# EAGLE board PCB-CMB-6_SKAARDUINO (EAGLE 7.1.0), part 1 of 2
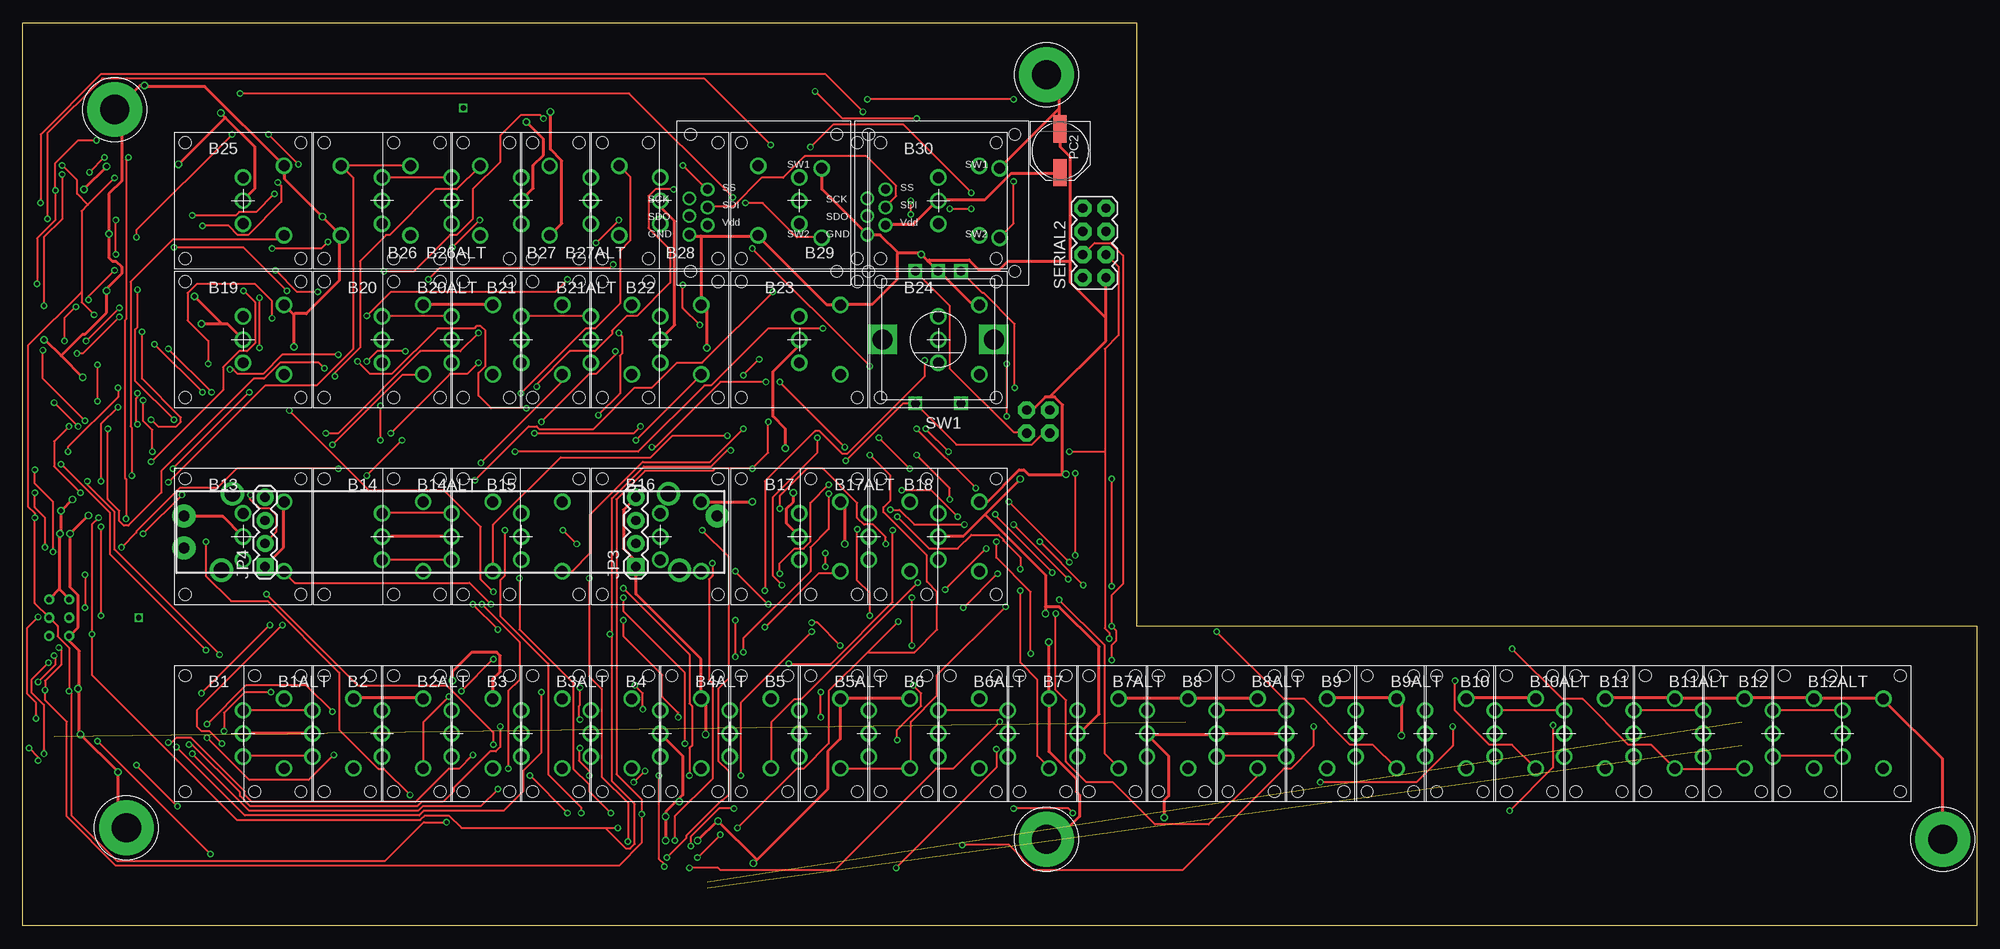
[diagram p6: board, top side]
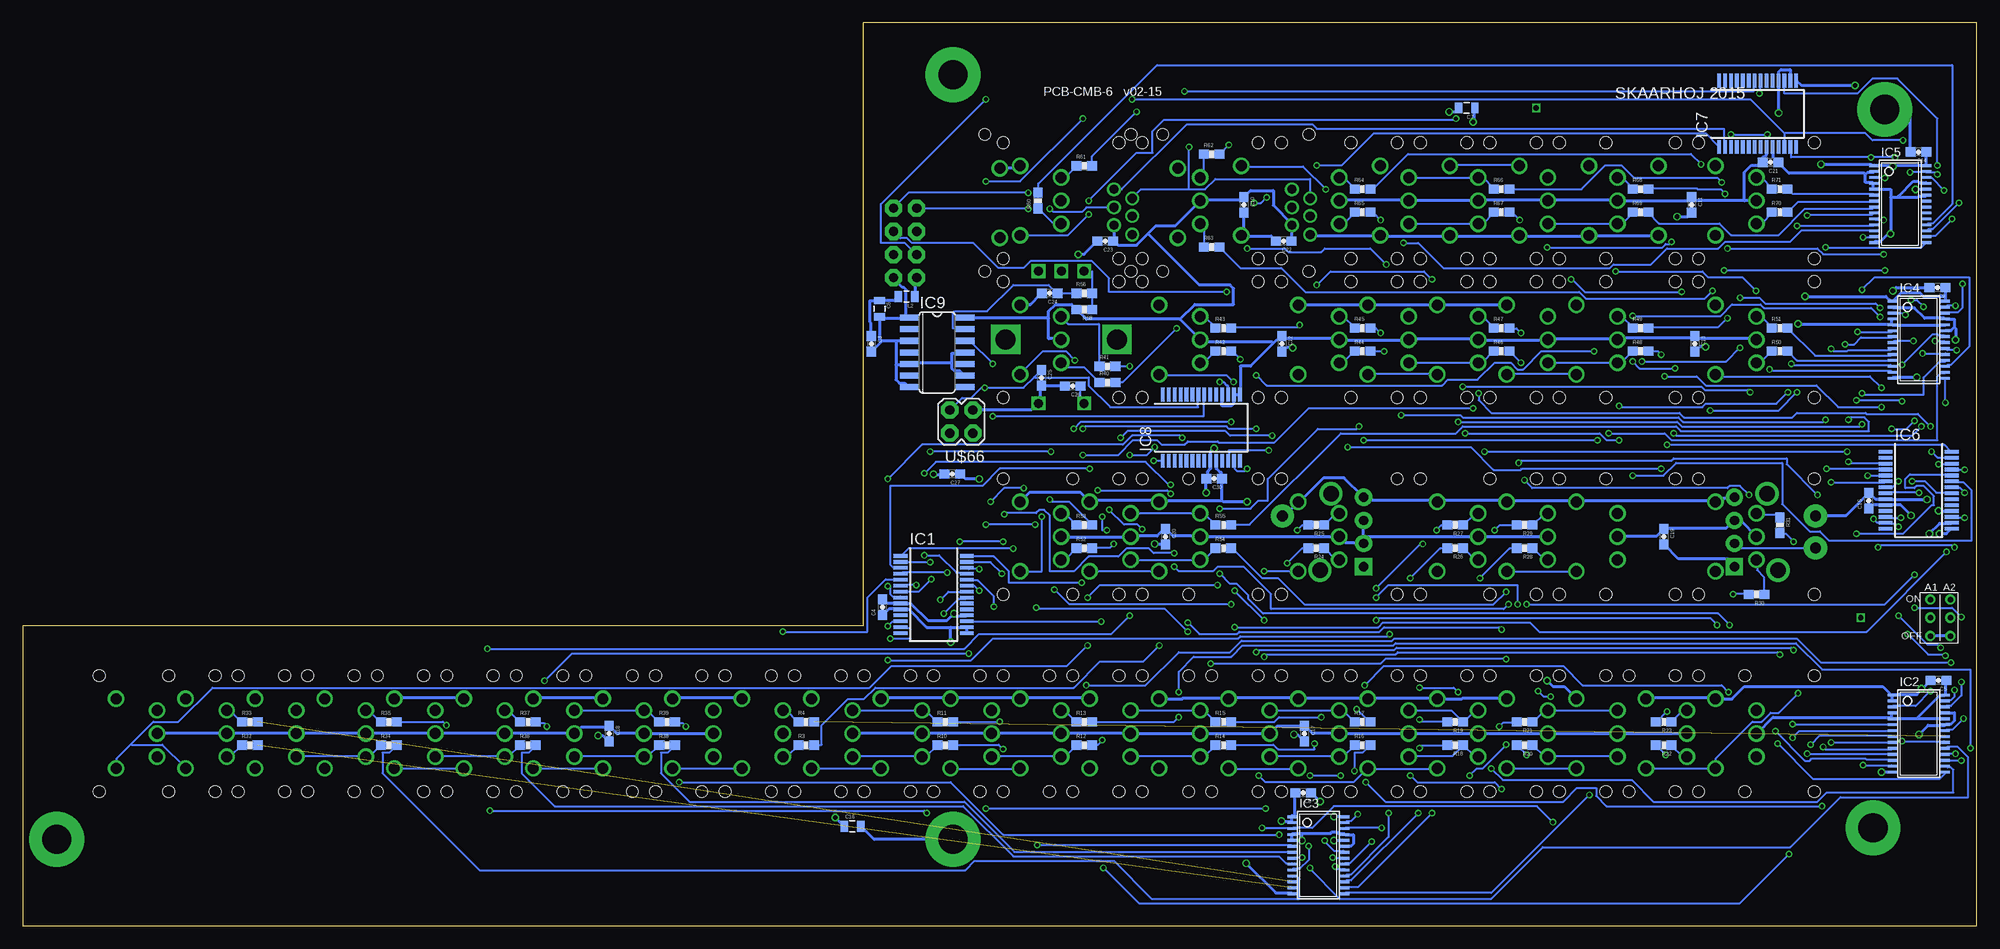
[diagram p7: board, bottom side, seen from below]

Size 214.11 x 99 mm. Coordinates in mm from the lower left corner, seen from the top.
Outline: 0,0 0,99 122.04,99 122.04,32.91 214.11,32.91 214.11,0 0,0
Copper layers (1*16): Top 0.035mm / dielectric 1.5mm / Bottom 0.035mm
Design rules "Fusion_eagle_rule_v1.1": minimum track width 6mil, minimum drill 12mil, track to track 6mil, track to pad 6mil, pad to pad 6mil, via to via 6mil, smd to smd 0mil, copper to edge 10mil, drill to drill 10mil, minimum pad ring 10mil, minimum via ring 6mil, stop-mask expansion 2mil, vias tented up to drill 100mil, thermal gap 10mil
Net classes: 0 default: width 0.203 mm, drill 0.406 mm, clearance 0.203 mm; 1 Power: width 0.356 mm, drill 0.508 mm, clearance 0.203 mm
tRestrict: area -3.8,-0.5 to 219.2,6; area -3.8,93.5 to 179.2,99.5
bRestrict: area -3.8,97 to 179.2,99.5; area -3.8,-0.5 to 219.2,2

## Footprints (pad centres in the part's own frame; a part is rotated, then mirrored left to right if it is on the bottom)
LP11 = drill 1.2: COM 0,0; P$2 0,2.54; P$3 0,-2.54; P$4 4.5,3.81; P$5 4.5,-3.81 | hole 1.3: -6.35,6.35; 6.35,6.35; 6.35,-6.35; -6.35,-6.35
0603-CAP = smd 1.1 x 1: 1 -0.85,0; 2 0.85,0
0805 = smd 0.8 x 1.2: 1 -0.9,0; 2 0.9,0
SSOP28 = smd 0.4 x 1.5: 1 -4.225,-3.625; 2 -3.575,-3.625; 3 -2.925,-3.625; 4 -2.275,-3.625; 5 -1.625,-3.625; 6 -0.975,-3.625; 7 -0.325,-3.625; 8 0.325,-3.625; 9 0.975,-3.625; 10 1.625,-3.625; 11 2.275,-3.625; 12 2.925,-3.625; 13 3.575,-3.625; 14 4.225,-3.625; 15 4.225,3.625; 16 3.575,3.625; 17 2.925,3.625; 18 2.275,3.625; 19 1.625,3.625; 20 0.975,3.625; 21 0.325,3.625; 22 -0.325,3.625; 23 -0.975,3.625; 24 -1.625,3.625; 25 -2.275,3.625; 26 -2.925,3.625; 27 -3.575,3.625; 28 -4.225,3.625
TSSOP28 = smd 0.305 x 0.991: 1 -4.225,-2.918; 2 -3.575,-2.918; 3 -2.925,-2.918; 4 -2.275,-2.918; 5 -1.625,-2.918; 6 -0.975,-2.918; 7 -0.325,-2.918; 8 0.325,-2.918; 9 0.975,-2.918; 10 1.625,-2.918; 11 2.275,-2.918; 12 2.925,-2.918; 13 3.575,-2.918; 14 4.225,-2.918; 15 4.225,2.918; 16 3.575,2.918; 17 2.925,2.918; 18 2.275,2.918; 19 1.625,2.918; 20 0.975,2.918; 21 0.325,2.918; 22 -0.325,2.918; 23 -0.975,2.918; 24 -1.625,2.918; 25 -2.275,2.918; 26 -2.925,2.918; 27 -3.575,2.918; 28 -4.225,2.918
SO14 = smd 0.66 x 2.032: 1 -3.81,-3.073; 2 -2.54,-3.073; 3 -1.27,-3.073; 4 0,-3.073; 5 1.27,-3.073; 6 2.54,-3.073; 7 3.81,-3.073; 8 3.81,3.073; 9 2.54,3.073; 10 1.27,3.073; 11 0,3.073; 12 -1.27,3.073; 13 -2.54,3.073; 14 -3.81,3.073
1X04 = drill 1.016 pad 1.88 square: 1 0,0 | drill 1.016 pad 1.88: 2 2.54,0; 3 5.08,0; 4 7.62,0
PANASONIC_D = smd 3 x 1.4: + 2.4,0; - -2.4,0
SLIDER45 = drill 1.194 pad 2.54: 1 -29.21,1.75; 2A -29.21,-1.75; 3 29.21,1.75 | drill 1.702: P$1 -23.9,4.2; P$2 23.9,4.2; P$3 25.1,-4.2; P$4 -25.1,-4.2
0603-RES = smd 1.1 x 1: 1 -0.85,0; 2 0.85,0
2X4 = drill 1.016 pad 1.88 octagon: 1 -3.81,-1.27; 2 -3.81,1.27; 3 -1.27,-1.27; 4 -1.27,1.27; 5 1.27,-1.27; 6 1.27,1.27; 7 3.81,-1.27; 8 3.81,1.27
SMART_SWITCH = drill 1.2: 1 6.35,3.81; 2 6.35,-3.81 | drill 1: 3 -8.153,-3.48; 4 -6.147,-2.413; 5 -8.153,-1.422; 6 -6.147,-0.483; 7 -8.153,0.508; 8 -6.147,1.499 | hole 1.3: -8.001,7.506; 8.001,7.506; 8.001,-7.506; -8.001,-7.506
ALPS_EC12E_SW = drill 1 square: A -2.5,-7.5; B 2.5,-7.5; C 0,-7.5; D -2.5,7; E 2.5,7 | drill 2.2 square: GND1 -6.1,0; GND2 6.1,0
3.2MMPAD6MM = drill 3.2 pad 6: P$1 0,0
2BITADDR = drill 0.6: A1 0,0; A2 2.2,0; H2 0,2; H3 2.2,2; L2 0,-2; L3 2.2,-2
2X2 = drill 1.016 pad 1.88 octagon: 1 -3.81,-1.27; 2 -3.81,1.27; 3 -1.27,-1.27; 4 -1.27,1.27

## Placement (x,y rotation side)
B1  LP11-B"  [LP11]  24.13,21.09 0 top
B1ALT  LP11-B"  [LP11]  31.75,21.09 0 top
B2  LP11-B"  [LP11]  39.37,21.09 0 top
B2ALT  LP11-B"  [LP11]  46.99,21.09 0 top
B3  LP11-B"  [LP11]  54.61,21.09 0 top
B3ALT  LP11-B"  [LP11]  62.23,21.09 0 top
B4  LP11-B"  [LP11]  69.85,21.09 0 top
B4ALT  LP11-B"  [LP11]  77.47,21.09 0 top
B5  LP11-B"  [LP11]  85.09,21.09 0 top
B5ALT  LP11-B"  [LP11]  92.71,21.09 0 top
B6  LP11-B"  [LP11]  100.33,21.09 0 top
B6ALT  LP11-B"  [LP11]  107.95,21.09 0 top
B7  LP11-B"  [LP11]  115.57,21.09 0 top
B7ALT  LP11-B"  [LP11]  123.19,21.09 0 top
B8  LP11-B"  [LP11]  130.81,21.09 0 top
B8ALT  LP11-B"  [LP11]  138.43,21.09 0 top
B9  LP11-B"  [LP11]  146.05,21.09 0 top
B9ALT  LP11-B"  [LP11]  153.67,21.09 0 top
B10  LP11-B"  [LP11]  161.29,21.09 0 top
B10ALT  LP11-B"  [LP11]  168.91,21.09 0 top
B11  LP11-B"  [LP11]  176.53,21.09 0 top
B11ALT  LP11-B"  [LP11]  184.15,21.09 0 top
B12  LP11-B"  [LP11]  191.77,21.09 0 top
B12ALT  LP11-B"  [LP11]  199.39,21.09 0 top
B13  LP11-B"  [LP11]  24.13,42.68 0 top
B14  LP11-B"  [LP11]  39.37,42.68 0 top
B14ALT  LP11-B"  [LP11]  46.99,42.68 0 top
B15  LP11-B"  [LP11]  54.61,42.68 0 top
B16  LP11-B"  [LP11]  69.85,42.68 0 top
B17  LP11-B"  [LP11]  85.09,42.68 0 top
B17ALT  LP11-B"  [LP11]  92.71,42.68 0 top
B18  LP11-B"  [LP11]  100.33,42.68 0 top
B19  LP11-B"  [LP11]  24.13,64.27 0 top
B20  LP11-B"  [LP11]  39.37,64.27 0 top
B20ALT  LP11-B"  [LP11]  46.99,64.27 0 top
B21  LP11-B"  [LP11]  54.61,64.27 0 top
B21ALT  LP11-B"  [LP11]  62.23,64.27 0 top
B22  LP11-B"  [LP11]  69.85,64.27 0 top
B23  LP11-B"  [LP11]  85.09,64.27 0 top
B24  LP11-B"  [LP11]  100.33,64.27 0 top
B25  LP11-B"  [LP11]  24.13,79.51 0 top
B26  LP11-B"  [LP11]  39.37,79.51 180 top
B26ALT  LP11-B"  [LP11]  46.99,79.51 180 top
B27  LP11-B"  [LP11]  54.61,79.51 180 top
B27ALT  LP11-B"  [LP11]  62.23,79.51 180 top
B28  LP11-B"  [LP11]  69.85,79.51 180 top
B29  LP11-B"  [LP11]  85.09,79.51 180 top
B30  LP11-B"  [LP11]  100.33,79.51 0 top
C3  100nF  [0603-CAP]  121.13,63.8 270 bottom
C4  100nF  [0603-CAP]  119.89,34.93 90 bottom
C5  100nF  [0603-CAP]  4.19,26.93 180 bottom
C6  22uF  [0805]  120.24,67.66 270 bottom
C7  22uF  [0805]  55.88,89.67 180 bottom
C8  100nF  [0603-CAP]  73.79,14.61 180 bottom
C9  100nF  [0603-CAP]  4.32,69.98 180 bottom
C10  100nF  [0603-CAP]  80.31,79.05 270 bottom
C11  100nF  [0603-CAP]  31.24,79.05 270 bottom
C12  100nF  [0603-CAP]  76.15,63.81 270 bottom
C13  100nF  [0603-CAP]  30.89,63.81 270 bottom
C14  100nF  [0603-CAP]  6.35,84.84 180 bottom
C15  100nF  [0603-CAP]  11.81,46.62 90 bottom
C16  22uF  [0805]  123.19,10.93 0 bottom
C17  100nF  [0603-CAP]  73.66,21.09 270 bottom
C18  100nF  [0603-CAP]  149.86,21.09 270 bottom
C19  100nF  [0603-CAP]  34.29,42.68 270 bottom
C20  100nF  [0603-CAP]  88.9,42.68 270 bottom
C21  100nF  [0603-CAP]  22.61,83.7 180 bottom
C22  100nF  [0603-CAP]  75.95,75.06 180 bottom
C23  100nF  [0603-CAP]  95.5,75.06 180 bottom
C24  10nF  [0603-CAP]  101.6,69.35 180 bottom
C25  10nF  [0603-CAP]  102.49,60.08 270 bottom
C26  10nF  [0603-CAP]  99.06,59.19 180 bottom
C27  100nF  [0603-CAP]  112.27,49.54 180 bottom
C30  100nF  [0603-CAP]  83.57,49.03 180 bottom
IC1  MCP23017SS  [SSOP28]  114.3,36.33 270 bottom
IC2  PCA9685  [TSSOP28]  6.35,21.09 270 bottom
IC3  PCA9685  [TSSOP28]  72.14,7.76 270 bottom
IC4  PCA9685  [TSSOP28]  6.35,64.27 270 bottom
IC5  PCA9685  [TSSOP28]  8.38,79.13 270 bottom
IC6  MCP23017SS  [SSOP28]  6.35,47.76 270 bottom
IC7  MCP23017SS  [SSOP28]  24,89.03 0 bottom
IC8  MCP23017SS  [SSOP28]  84.96,54.62 0 bottom
IC9  74HCT14D  [SO14]  113.92,62.87 270 bottom
JP3  [1X04]  67.18,39.38 90 top
JP4  [1X04]  26.54,39.38 90 top
L2  [0805]  117.27,68.99 180 bottom
PC2  47u  [PANASONIC_D]  113.66,84.97 270 top
POT1  SLIDER45  [SLIDER45]  46.86,43.19 0 top
R3  270  [0603-RES]  128.27,19.82 0 bottom
R4  270  [0603-RES]  128.27,22.36 0 bottom
R10  270  [0603-RES]  113.03,19.82 0 bottom
R11  270  [0603-RES]  113.03,22.36 0 bottom
R12  270  [0603-RES]  97.79,19.82 0 bottom
R13  270  [0603-RES]  97.79,22.36 0 bottom
R14  270  [0603-RES]  82.55,19.82 0 bottom
R15  270  [0603-RES]  82.55,22.36 0 bottom
R16  270  [0603-RES]  67.31,19.82 0 bottom
R17  270  [0603-RES]  67.31,22.36 0 bottom
R18  270  [0603-RES]  57.15,19.82 180 bottom
R19  270  [0603-RES]  57.15,22.36 180 bottom
R20  270  [0603-RES]  49.53,19.82 180 bottom
R21  270  [0603-RES]  49.53,22.36 180 bottom
R22  270  [0603-RES]  34.29,19.82 180 bottom
R23  270  [0603-RES]  34.29,22.36 180 bottom
R24  270  [0603-RES]  72.39,41.41 180 bottom
R25  270  [0603-RES]  72.39,43.95 180 bottom
R26  270  [0603-RES]  57.15,41.41 180 bottom
R27  270  [0603-RES]  57.15,43.95 180 bottom
R28  270  [0603-RES]  49.53,41.41 180 bottom
R29  270  [0603-RES]  49.53,43.95 180 bottom
R30  270  [0603-RES]  24.13,36.33 180 bottom
R31  270  [0603-RES]  21.59,43.95 270 bottom
R32  270  [0603-RES]  189.23,19.82 0 bottom
R33  270  [0603-RES]  189.23,22.36 0 bottom
R34  270  [0603-RES]  173.99,19.82 0 bottom
R35  270  [0603-RES]  173.99,22.36 0 bottom
R36  270  [0603-RES]  158.75,19.82 0 bottom
R37  270  [0603-RES]  158.75,22.36 0 bottom
R38  270  [0603-RES]  143.51,19.82 0 bottom
R39  270  [0603-RES]  143.51,22.36 0 bottom
R40  270  [0603-RES]  95.25,59.57 0 bottom
R41  270  [0603-RES]  95.25,61.35 0 bottom
R42  270  [0603-RES]  82.55,63 0 bottom
R43  270  [0603-RES]  82.55,65.54 0 bottom
R44  270  [0603-RES]  67.31,63 0 bottom
R45  270  [0603-RES]  67.31,65.54 0 bottom
R46  270  [0603-RES]  52.07,63 0 bottom
R47  270  [0603-RES]  52.07,65.54 0 bottom
R48  270  [0603-RES]  36.83,63 0 bottom
R49  270  [0603-RES]  36.83,65.54 0 bottom
R50  270  [0603-RES]  21.59,63 0 bottom
R51  270  [0603-RES]  21.59,65.54 0 bottom
R52  270  [0603-RES]  97.79,41.41 0 bottom
R53  270  [0603-RES]  97.79,43.95 0 bottom
R54  270  [0603-RES]  82.55,41.41 0 bottom
R55  270  [0603-RES]  82.55,43.95 0 bottom
R56  0R  [0603-RES]  97.79,69.35 0 bottom
R58  100K  [0603-RES]  97.79,67.57 180 bottom
R60  270  [0603-RES]  102.87,79.51 90 bottom
R61  270  [0603-RES]  97.79,83.32 0 bottom
R62  270  [0603-RES]  83.82,84.59 0 bottom
R63  270  [0603-RES]  83.82,74.43 0 bottom
R64  270  [0603-RES]  67.31,80.78 0 bottom
R65  270  [0603-RES]  67.31,78.24 0 bottom
R66  270  [0603-RES]  52.07,80.78 0 bottom
R67  270  [0603-RES]  52.07,78.24 0 bottom
R68  270  [0603-RES]  36.83,80.78 0 bottom
R69  270  [0603-RES]  36.83,78.24 0 bottom
R70  270  [0603-RES]  21.59,78.24 0 bottom
R71  270  [0603-RES]  21.59,80.78 0 bottom
SERIAL2  M04X2  [2X4]  117.43,74.87 90 top
SSW1  SMART_SWITCHSMART_SWITCH_8PIN  [SMART_SWITCH]  81.19,79.25 0 top
SSW2  SMART_SWITCHSMART_SWITCH_8PIN  [SMART_SWITCH]  100.69,79.25 0 top
SW1  EC12E_SW  [ALPS_EC12E_SW]  100.31,64.29 180 top
U$7  GNDPAD6MM  [3.2MMPAD6MM]  210.38,9.5 0 top
U$15  GNDPAD6MM  [3.2MMPAD6MM]  112.19,9.5 0 top
U$18  GNDPAD6MM  [3.2MMPAD6MM]  112.19,93.31 0 top
U$20  GNDPAD6MM  [3.2MMPAD6MM]  11.35,10.77 0 top
U$21  GNDPAD6MM  [3.2MMPAD6MM]  10.08,89.5 0 top
U$34  2BITADDR  [2BITADDR]  5.08,33.79 0 bottom
U$66  M02X2  [2X2]  113.81,55.29 180 bottom

## Tracks (layer width: path | path; a pad name or v marks a point on that pad's centre or on a via)
5V  (via drill 0.51)
  Top 0.356: v9.19,83.25 v6.69,80.75 | 22.19,88.62 25.44,85.38 25.44,80.88 24.19,79.62 B25.COM | 22.19,88.62 v21.69,89.12 | 22.19,88.62 v17.07,83.5 | v55.19,88.12 57.06,86.25 57.06,84.5 55.94,83.38 55.94,80.88 54.69,79.62 B27.COM | PC2.+ 113.56,82.5 108.31,82.5 105.44,79.62 100.44,79.62 B30.COM 100.19,79.5 97.56,76.88 94.56,76.88 SSW2.4 | 21.69,66 22.44,66 24.07,64.38 B19.COM | 21.69,66 v19.57,66 | v18.82,69 21.69,66.12 21.69,66 | B28.COM 69.94,79.5 69.94,78.75 71.44,77.25 71.44,65.88 69.94,64.38 B22.COM | v84.44,47.5 84.44,46.5 83.69,45.75 83.69,44.12 85.06,42.75 B17.COM | 105.44,45.12 103.06,42.75 100.44,42.75 B18.COM | 105.44,45.12 v109.31,49 | 112.06,35 112.06,38.5 105.44,45.12 | 112.06,35 v112.06,34.25 | 4.06,36.88 v4.06,43 4.19,43.12 v4.19,45.5 v5.44,46.75 | 4.06,36.88 5.06,35.88 U$34.H2 | U$34.H3 2.94,35.88 3.94,36.88 4.06,36.88 | B14ALT.COM 46.94,42.75 39.44,42.75 B14.COM | POT1.1 17.69,44.88 21.94,44.88 24.07,42.75 B13.COM | v125.06,11.88 125.06,13.75 125.56,14.25 125.56,18.62 123.19,21 B7ALT.COM 123.44,21 130.69,21 B8.COM 130.94,21.12 138.31,21.12 B8ALT.COM | B1.COM 24.19,21.12 31.69,21.12 B1ALT.COM | v70.44,9.38 v70.44,12 70.44,12.5 71.69,13.75 | 71.69,13.75 72.31,14.38 72.31,18.62 B4.COM | v71.94,13.62 71.81,13.62 71.69,13.75 | 112.06,35 113.56,35 117.94,30.62 117.94,23.25 115.69,21 B7.COM | v83.56,52.38 83.56,54.5 82.19,55.88 82.19,60.75 85.06,63.62 85.06,64.25 B23.COM
  Bottom 0.356: C14.1 5.56,84.75 5.56,83.38 IC5.28 5.69,83.38 9.06,83.38 v9.19,83.25 9.31,83.38 11.19,83.38 IC5.1 11.44,83.38 11.56,83.5 v17.07,83.5 | v6.69,80.75 5.56,80.75 IC5.24 | IC7.16 20.44,92.75 20.44,93.88 21.44,93.88 21.69,93.62 21.69,92.75 IC7.18 21.69,92.5 v21.69,89.12 | IC7.9 23.07,85.38 23.07,84.5 23.32,84.25 23.44,84.25 23.44,83.75 C21.2 23.57,83.62 23.82,83.38 24.69,83.38 25.44,82.62 25.44,79.5 | 25.44,79.5 24.19,79.5 B25.COM | 25.44,79.5 30.82,79.5 31.19,79.88 C11.1 31.32,79.75 31.57,79.5 39.19,79.5 B26.COM 39.44,79.62 46.94,79.62 B26ALT.COM 47.06,79.62 54.56,79.62 B27.COM 54.69,79.5 62.06,79.5 B27ALT.COM 62.31,79.62 69.81,79.62 B28.COM | v55.19,88.12 55.06,88.12 55.06,89.62 C7.1 | C22.1 75.06,75.12 75.06,76.75 SSW1.4 75.06,77 77.06,79 77.06,80.62 79.56,80.62 80.19,80 C10.1 80.31,79.88 80.56,79.62 85.06,79.62 B29.COM 85.19,79.38 87.81,76.75 89.94,76.75 90.81,75.88 | SSW2.4 94.56,76.75 94.56,75.12 C23.1 94.44,75 94.06,74.62 92.06,74.62 90.81,75.88 | 3.44,69 3.44,69.88 C9.1 | 3.44,69 IC4.28 | 3.44,69 5.81,69 6.19,69.38 8.31,69.38 9.19,68.5 IC4.1 9.44,68.5 9.94,69 v18.82,69 | IC4.24 3.44,65.88 9.19,65.88 IC4.5 | IC4.4 9.31,66.5 9.31,66 IC4.5 | B19.COM 24.19,64.38 30.57,64.38 30.82,64.62 C13.1 31.07,64.62 31.19,64.5 39.31,64.5 B20.COM 39.44,64.38 46.94,64.38 B20ALT.COM 47.06,64.25 54.44,64.25 B21.COM 54.69,64.38 62.19,64.38 B21ALT.COM 62.31,64.25 69.69,64.25 B22.COM 69.94,64.38 75.81,64.38 76.06,64.62 C12.1 76.31,64.62 77.06,63.88 | v19.57,66 9.44,66 IC4.5 | 101.69,66.62 101.69,64.38 100.44,64.38 B24.COM | 101.69,66.62 101.69,67.38 100.94,68.12 99.19,68.12 98.69,67.62 R58.2 98.56,67.5 97.56,66.5 87.31,66.5
  Bottom 0.356: 101.69,66.62 110.81,66.62 IC9.14 | IC8.18 82.69,58.12 82.69,57 81.69,57 81.44,57.25 81.44,58.12 IC8.16 81.31,58.25 80.81,58.25 IC8.15 80.69,58.38 80.69,61.38 79.56,61.38 77.06,63.88 | 77.06,63.88 77.19,64 84.81,64 85.06,64.25 B23.COM 85.19,64.38 87.31,66.5 | 90.81,75.88 85.19,70.25 81.81,70.25 81.44,69.88 81.44,68.12 85.69,68.12 87.31,66.5 | v84.44,47.5 84.44,48.88 C30.2 84.31,49.12 84.31,49.75 83.94,50.12 83.94,50.88 IC8.9 83.94,51.12 83.94,52 v83.56,52.38 | C4.2 119.81,35.75 119.44,35.38 117.94,35.38 IC1.9 117.81,35.38 116.81,35.38 114.94,33.5 112.81,33.5 112.31,34 112.06,34 | 112.06,34 110.69,34 IC1.18 | v109.31,49 110.81,49 111.31,49.5 C27.1 | v112.06,34.25 112.06,34 | B18.COM 100.31,42.62 92.81,42.62 B17ALT.COM 92.69,42.75 89.81,42.75 89.06,43.5 C20.1 88.81,43.5 88.06,42.75 85.19,42.75 B17.COM 84.94,42.62 69.94,42.62 B16.COM 69.81,42.62 69.19,42 67.19,42 JP3.2 | v4.06,43 3.31,43 2.81,43.5 IC6.15 | v4.19,45.5 2.81,45.5 IC6.18 | POT1.1 17.57,45 14.31,45 11.94,47.38 C15.2 11.69,47.38 11.06,46.75 10.06,46.75 IC6.9 9.81,46.75 v5.44,46.75 | JP3.3 67.19,44.38 67.19,42.12 JP3.2 | B13.COM 24.19,42.75 25.82,44.38 26.44,44.38 JP4.3 26.69,44.38 27.44,43.62 34.19,43.62 C19.1 34.31,43.5 35.06,42.75 39.31,42.75 B14.COM | B14ALT.COM 47.06,42.62 54.56,42.62 B15.COM 54.69,42.62 67.06,42.62 JP3.2 | v125.06,11.88 124.19,11 C16.1 | B12ALT.COM 199.31,21.12 191.94,21.12 B12.COM 191.69,21.12 184.31,21.12 B11ALT.COM 184.06,21.12 176.69,21.12 B11.COM 176.44,21.12 169.06,21.12 B10ALT.COM 168.81,21.12 161.44,21.12 B10.COM 161.19,21.12 153.81,21.12 B9ALT.COM 153.56,21.12 152.94,21.75 149.94,21.75 C18.1 149.81,21.88 149.06,21.12 146.06,21.12 B9.COM 145.94,21.12 138.44,21.12 B8ALT.COM
  Bottom 0.356: C5.1 3.44,26.88 3.44,25.38 IC2.28 3.56,25.25 4.06,25.25 6.44,22.88 6.44,22.75 | 9.19,22.75 6.44,22.75 | 6.44,22.75 3.44,22.75 IC2.24 | 9.19,22.75 IC2.5 | 9.31,22.88 9.31,23.25 IC2.4 | 9.31,22.88 9.19,22.75 | 9.31,22.88 22.32,22.88 24.07,21.12 B1.COM | v70.44,9.38 69.31,9.38 IC3.24 | v70.44,12 69.31,12 IC3.28 | v71.94,13.62 72.81,14.5 C8.1 | B1ALT.COM 31.82,21.12 39.31,21.12 B2.COM 39.44,21.12 46.94,21.12 B2ALT.COM 47.06,21.12 54.44,21.12 B3.COM 54.69,21.12 62.19,21.12 B3ALT.COM 62.31,21.12 69.69,21.12 B4.COM 69.94,21.12 72.81,21.12 73.56,21.88 C17.1 73.81,21.88 76.69,21.88 77.44,21.12 B4ALT.COM 77.56,21.12 84.94,21.12 B5.COM 85.19,21.12 92.69,21.12 B5ALT.COM 92.81,21.12 100.31,21.12 B6.COM 100.44,21.12 107.94,21.12 B6ALT.COM 108.06,21.12 115.56,21.12 B7.COM 115.69,21.12 123.19,21.12 B7ALT.COM
5V_RAW
  Bottom 0.356: C3.1 121.19,64.75 121.19,66.12 121.31,66.25 121.31,68.5 120.31,68.5 C6.1 120.19,68.62 118.44,68.62 118.19,68.88 L2.2
A0  (via drill 0.41)
  Top 0.203: v82.19,69.5 74.44,61.75 71.69,61.75 68.94,59 67.06,59 62.56,54.5 56.56,54.5 56.31,54.75 55.44,54.75 v49.56,48.88 | v24.94,47.25 24.94,46.75 25.94,45.75 27.07,45.75 27.82,45 27.82,43.25 26.57,42 JP4.2
  Bottom 0.203: JP4.2 26.44,41.88 25.94,41.38 17.69,41.38 POT1.2A | v82.19,69.5 95.06,69.5 95.06,71 96.94,72.88 103.69,72.88 104.44,72.12 107.19,72.12 109.94,74.88 116.69,74.88 117.19,75.38 117.94,75.38 118.69,76.12 SERIAL2.5 | v49.56,48.88 48.69,48 27.32,48 27.07,48.25 25.94,48.25 v24.94,47.25
A2  (via drill 0.41)
  Top 0.203: v78.31,10.75 84.81,17.25 85.56,17.25 88.31,20 88.31,25.75 92.63,30.06 | v95.94,33.38 92.63,30.06 | v90.06,52.5 v82.94,59.62 | v92.81,51.62 95.06,49.38 95.06,46.62 94.31,45.88 94.31,45.38 99.06,40.62 99.06,37.75 100.19,36.62 100.19,32.5 97.69,30 92.69,30 92.63,30.06 | v7.81,67 6.44,68.38 6.44,69.5 | 6.44,69.5 6.44,78.38 7.13,79.06 | v10.06,82 7.13,79.06 | v4.31,83.38 5.94,81.75 5.94,80.25 7.13,79.06 | 6.44,69.5 0.56,63.62 0.56,46 1.31,45.25 v1.31,44.75 1.31,35.38 2.81,33.88 U$34.A2 2.94,33.75 3.81,32.88 3.81,31.75 5.06,30.5 v5.06,25.75 5.31,25.5 5.31,12.12 10.31,7.12 39.69,7.12 43.94,11.38 v46.44,11.38
  Bottom 0.203: v78.31,10.75 75.06,10.75 IC3.3 74.94,10.75 72.81,10.75 70.44,13.12 48.19,13.12 v46.44,11.38 | v95.94,33.38 110.56,33.38 IC1.17 | v82.94,59.62 82.56,59.62 82.19,59.25 82.06,59.25 82.06,58.25 IC8.17 | v90.06,52.5 90.94,51.62 v92.81,51.62 | v5.06,25.75 6.69,24.12 9.19,24.12 IC2.3 | v1.31,44.75 2.69,44.75 IC6.17 | v7.81,67 7.94,67.12 9.19,67.12 IC4.3 | v10.06,82 11.19,82 IC5.3 | v4.31,83.38 4.31,88.5 8.69,92.88 11.44,92.88 13.06,91.25 21.07,91.25 21.07,92.62 IC7.17
AD0  (via drill 0.41)
  Top 0.203: v90.19,51 96.44,57.25 97.69,57.25 SW1.E 97.81,57.25 102.31,52.75 110.56,52.75 111.81,54 112.44,54 U$66.4
  Bottom 0.203: C26.1 98.19,59.12 98.19,57.38 97.81,57.38 SW1.E | v90.19,51 IC8.1
D2  (via drill 0.41)
  Top 0.203: v107.81,61.62 v107.81,55.88
  Bottom 0.203: v107.81,55.88 84.69,55.88 84.69,58.12 IC8.21 | v107.81,61.62 110.31,64.12 110.81,64.12 IC9.12
D3  (via drill 0.41)
  Top 0.203: v108.69,59 108.69,66 105.31,69.38 105.19,69.38 102.81,71.75 SW1.A
  Bottom 0.203: 103.25,60.19 104.44,59 v108.69,59 109.06,59 110.19,57.88 111.19,57.88 112.44,56.62 U$66.3 | 103.25,60.19 102.56,60.88 C25.1 | IC8.22 85.31,58.12 85.31,56.88 94.94,56.88 97.31,59.25 97.31,60.12 103.19,60.12 103.25,60.19
GND  (via drill 0.51)
  Top 0.356: 113.56,89.5 113.56,91.88 112.19,93.25 U$18.P$1 | 113.56,89.5 113.56,87.38 PC2.- 113.69,87.25 113.69,85.38 114.81,84.25 114.81,72.88 | SSW2.1 107.06,83.12 113.44,89.5 113.56,89.5 | B18.P$4 104.94,46.5 105.69,46.5 109.19,50 109.69,50 110.19,49.5 v114.31,49.5 113.94,49.62 113.94,57.12 113.06,58 112.69,58 | v90.06,41.88 90.06,46 89.69,46.38 B17.P$4 | 112.69,58 112.06,58 110.69,56.62 110.06,56.62 U$66.1 | 118.69,66.75 118.69,64.12 112.69,58.12 112.69,58 | 118.69,66.75 118.69,71 SERIAL2.1 | 114.81,72.88 114.81,70.5 118.56,66.75 118.69,66.75 | 4.19,62.5 2.44,64.25 v2.31,64.25 | 4.19,62.5 v6.56,60.12 | 4.19,62.5 6.56,64.88 6.81,64.88 9.19,67.25 v9.19,69.62 9.31,69.75 9.31,70 10.81,71.5 10.81,72.25 10.19,72.88 9.81,72.88 9.44,73.25 v9.44,75.88 9.44,80.25 10.81,81.62 10.81,89.88 U$21.P$1 10.19,89.5 12.81,92.12 v13.31,92.12 13.44,92 19.94,92 28.57,83.38 B25.P$4 28.69,83.25 28.69,81.88 v32.81,77.75 34.81,75.75 B26.P$4 34.69,75.62 34.69,70.75 31.07,67.12 29.82,67.12 29.69,67 | 29.69,67 v29.69,63.5 | 29.69,67 28.69,68 B19.P$4 | 99.19,72.88 100.19,71.88 SW1.C 100.44,71.75 104.06,68.12 104.81,68.12 B24.P$4 | 99.19,72.88 v98.44,73.62 98.31,73.75 95.94,73.75 | 95.94,73.75 93.94,75.75 92.56,75.75 SSW2.3 92.44,75.88 87.56,80.75 87.56,83 SSW1.1 | 95.94,73.75 95.81,73.62 95.81,70.88 93.06,68.12 89.69,68.12 B23.P$4 89.44,68.12 88.06,68.12 80.69,75.5 B29.P$4 80.56,75.62 74.31,75.62 | B20.P$4 43.94,68.12 51.44,68.12 B20ALT.P$4 | v57.81,89.25 57.81,85.12 59.06,83.88 59.06,77 57.81,75.75 B27ALT.P$4 | v74.94,63.38 74.94,67.5 74.44,68 B22.P$4 74.31,68.25 74.31,75.62
  Top 0.356: 74.31,75.62 73.19,75.62 73.06,75.75 SSW1.3 | 114.81,72.88 107.94,72.88 107.06,72 104.69,72 103.69,73 99.31,73 99.19,72.88 | B10ALT.P$4 173.44,25 180.94,25 B11.P$4 181.06,25 188.56,25 B11ALT.P$4 188.69,25 196.19,25 B12.P$4 196.31,25 203.81,25 B12ALT.P$4 203.94,24.75 210.31,18.38 210.31,9.5 U$7.P$1 | B9ALT.P$4 158.19,25 165.69,25 B10.P$4 | v151.06,20.88 151.06,24.38 150.56,24.88 B9.P$4 150.44,25 142.94,25 B8ALT.P$4 | B1ALT.P$4 36.31,25 43.81,25 B2.P$4 | v7.19,45 v5.19,43 5.19,37.12 6.06,36.25 6.06,32.75 5.19,31.88 U$34.L2 5.06,31.62 5.06,31.25 6.19,30.12 6.19,26 | U$20.P$1 11.31,10.88 10.44,11.75 v10.44,16.88 v6.31,21 6.19,21.12 6.19,26 | v6.06,26 6.19,26 | JP3.4 67.06,46.88 65.81,45.62 65.81,41.38 67.06,40.12 67.06,39.5 JP3.1 67.19,39.25 67.19,36.38 74.31,29.25 74.31,25 B4.P$4 74.44,24.88 74.81,24.5 v74.81,21 | B13.P$4 28.57,46.38 28.57,41.5 26.57,39.5 JP4.1 | 80.44,7.25 88.19,15 88.19,19.12 89.56,20.5 89.56,24.88 B5.P$4 89.69,25 97.19,25 B5ALT.P$4 | 80.44,7.25 v80.06,6.88 | 80.44,7.25 v76.19,11.5 76.06,11.5 v73.94,9.38 | B7.P$4 120.19,25 127.69,25 B7ALT.P$4 127.81,25 135.19,25 B8.P$4 | v112.44,31.12 112.44,25 B6ALT.P$4 112.44,24.75 112.44,19.12 115.44,16.12 115.44,14.75 115.81,14.38 115.81,12 113.31,9.5 U$15.P$1 | v47.06,26.88 47.06,27.88 49.19,30 51.94,30 52.31,29.62 52.31,27.88 51.56,27.12 51.56,25 B2ALT.P$4 | v79.94,46.5 74.44,46.5 B16.P$4
  Bottom 0.356: B30.P$4 104.94,83.25 105.06,83.12 106.94,83.12 SSW2.1 | 112.31,61.75 112.31,62.75 110.94,62.75 IC9.11 | 112.31,61.75 112.31,61.12 112.06,60.88 111.44,60.88 110.94,60.38 IC9.9 | 118.44,61.5 118.44,59.88 118.06,59.5 117.44,59.5 117.06,59.12 IC9.7 | 118.44,61.5 117.06,61.5 IC9.5 116.94,61.75 112.31,61.75 | 119.94,64.12 121.06,63 C3.2 | 118.44,64.12 117.06,64.12 IC9.3 | 118.44,64.12 119.94,64.12 | 119.94,64.12 120.06,64.25 120.19,64.25 120.19,66.75 C6.2 120.06,66.62 117.06,66.62 IC9.1 117.31,66.75 117.31,69.75 117.56,70 117.69,70 118.69,71 SERIAL2.1 | 118.44,64.12 118.44,61.5 | C26.2 99.94,59.25 102.44,59.25 C25.2 102.56,59.12 102.56,57.38 102.69,57.38 SW1.D 102.94,57.25 103.56,56.62 109.94,56.62 U$66.1 | v114.31,49.5 113.19,49.5 C27.2 | IC8.10 83.31,50.88 83.31,50.12 82.94,49.75 82.81,49.75 82.81,49.12 C30.1 82.69,48.88 82.69,46.62 | v90.06,41.88 88.94,41.88 C20.2 | 82.69,46.62 89.44,46.62 89.56,46.5 B17.P$4 89.69,46.62 97.06,46.62 97.19,46.5 B17ALT.P$4 97.31,46.62 98.19,47.5 103.81,47.5 104.81,46.5 B18.P$4 | IC7.10 22.32,85.38 22.32,84.25 21.82,83.75 C21.1 21.69,83.62 20.57,82.5 12.31,82.5 12.19,82.38 | 9.56,76 9.44,76.12 9.44,79.88 | 9.56,76 10.56,75 11.19,75 IC5.14 | 9.44,79.88 9.44,80.75 11.19,80.75 IC5.5 11.31,80.88 11.31,81.38 IC5.4 11.44,81.5 12.19,81.5 12.19,82.38 | 9.44,79.88 8.56,79.88 | 8.56,79.88 6.44,79.88 6.31,80 5.56,80 IC5.23 | IC5.25 5.56,81.5 6.31,81.5 6.44,81.62 6.94,81.62 8.56,80 8.56,79.88 | 12.19,82.38 11.94,82.62 11.31,82.62 IC5.2 | 2.44,65.62 2.81,65.25 3.31,65.25 IC4.23 | 2.44,65.62 2.44,66.5 3.31,66.5 IC4.25 3.56,66.62 5.69,66.62 6.81,67.75 9.19,67.75 IC4.2
  Bottom 0.356: v6.56,60.12 9.19,60.12 IC4.14 | v2.31,64.25 2.31,65.5 2.44,65.62 | v9.19,69.62 8.81,70 5.19,70 C9.2 | U$21.P$1 7.31,89.5 7.31,84.88 C14.2 | v13.31,92.12 19.19,92.12 19.69,92.62 IC7.15 | v9.44,75.88 9.56,76 | v29.69,63.5 30.32,63.5 30.82,63 C13.2 | C11.2 31.69,77.75 v32.81,77.75 | B26.P$4 34.94,75.62 42.31,75.62 B26ALT.P$4 42.56,75.62 50.06,75.62 B27.P$4 50.19,75.62 57.56,75.62 B27ALT.P$4 57.81,75.62 65.19,75.62 B28.P$4 65.44,75.62 72.81,75.62 72.94,75.75 SSW1.3 | C24.2 102.56,69.25 103.69,68.12 104.81,68.12 B24.P$4 | v98.44,73.62 97.81,73.62 96.44,75 C23.2 | B20ALT.P$4 51.56,68.12 58.94,68.12 B21.P$4 59.19,68.12 66.69,68.12 B21ALT.P$4 66.81,68.12 74.31,68.12 B22.P$4 | v57.81,89.25 57.19,89.25 56.81,89.62 C7.2 | v74.94,63.38 75.69,63.38 76.06,63 C12.2 | C22.2 76.81,75.12 77.31,75.62 80.56,75.62 B29.P$4 80.31,75.75 80.31,78.12 C10.2 | v151.06,20.88 150.56,20.88 149.94,20.25 C18.2 | B9ALT.P$4 158.06,25 150.56,25 B9.P$4 | B10ALT.P$4 173.31,25 165.81,25 B10.P$4 | IC2.2 9.31,24.75 9.31,25.25 IC2.1 | 6,25.94 6.56,25.38 9.19,25.38 IC2.1 | 6,25.94 5.06,26.88 C5.2 | IC2.1 9.44,25.38 10.31,26.25 25.44,26.25 26.82,24.88 28.57,24.88 B1.P$4 28.69,25 36.19,25 B1ALT.P$4 | C15.1 11.69,45.88 11.44,46.12 10.06,46.12 IC6.10 9.81,46.12 8.31,46.12 v7.19,45 | v5.19,43 4.06,44.12 2.81,44.12 IC6.16 | U$34.L3 2.94,31.88 5.06,31.88 U$34.L2 | IC2.25 3.31,23.38 2.44,23.38 2.44,22.5 2.81,22.12 3.31,22.12 IC2.23 3.56,22 5.31,22 v6.31,21 | v10.44,16.88 9.31,16.88 IC2.14 | v6.06,26 6,25.94 | POT1.3 76.06,45 75.81,45 74.44,46.38 B16.P$4 74.19,46.5 71.56,49.12 69.31,49.12 JP3.4 67.06,46.88 66.81,46.62 59.19,46.62 B15.P$4 59.06,46.5 58.94,46.62 51.56,46.62 B14ALT.P$4 51.44,46.5 51.31,46.62 44.06,46.62 43.94,46.5 B14.P$4 43.81,46.62 28.69,46.62 B13.P$4 28.57,46.5 28.19,46.88 26.57,46.88 JP4.4
  Bottom 0.356: C19.2 34.19,41.75 32.69,40.25 27.32,40.25 26.57,39.5 JP4.1 | B2ALT.P$4 51.56,25 56.31,25 56.44,24.88 59.06,24.88 B3.P$4 59.19,25 66.69,25 B3ALT.P$4 66.81,25 74.31,25 B4.P$4 74.44,25 81.94,25 B4ALT.P$4 82.06,25 86.94,25 87.06,24.88 89.56,24.88 B5.P$4 | v74.81,21 74.44,21 73.69,20.25 C17.2 | U$15.P$1 120.81,9.5 122.19,10.88 C16.2 | IC1.15 110.69,32.12 110.69,32.75 IC1.16 110.81,32.75 112.44,32.75 | C4.1 119.81,34.12 119.19,34.75 117.94,34.75 IC1.10 117.81,34.75 117.06,34.75 115.06,32.75 112.44,32.75 | IC3.5 75.06,9.5 75.06,10 IC3.4 74.94,10.12 73.94,10.12 | IC3.23 69.19,8.75 68.56,8.75 68.31,9 68.31,10 69.19,10 IC3.25 69.31,10.12 69.94,10.12 70.06,10.25 70.69,10.25 70.81,10.12 73.94,10.12 | 75.06,11.5 75.06,11.88 IC3.1 75.06,12.12 74.69,12.12 74.69,14.5 C8.2 | 75.06,11.5 75.06,11.38 IC3.2 | v80.06,6.88 76.81,3.62 75.06,3.62 IC3.14 | v76.19,11.5 75.06,11.5 | v73.94,9.38 73.94,10.12 | B5ALT.P$4 97.31,25 104.81,25 B6.P$4 104.94,25 112.44,25 B6ALT.P$4 112.56,25 120.06,25 B7.P$4 | v112.44,31.12 112.44,32.75 | v47.06,26.88 46.44,26.25 45.19,26.25 43.94,25 B2.P$4 | B8ALT.P$4 142.81,25 135.31,25 B8.P$4 | v79.94,46.5 82.56,46.5 82.69,46.62
GPA0  (via drill 0.41)
  Top 0.203: v113.19,34.25 113.19,25.88 114.31,24.75 114.31,18 116.56,15.75 119.44,15.75 124.06,11.12 129.94,11.12 135.19,16.38 135.19,17.25 B8.P$5
  Bottom 0.203: v113.19,34.25 111.56,35.88 110.81,35.88 110.69,36 IC1.21 | B8ALT.P$5 142.81,17.25 135.31,17.25 B8.P$5
GPA0_2  (via drill 0.41)
  Top 0.203: v23.82,91.25 66.44,91.25 v77.81,79.88 | v79.19,79.25 81.06,79.25 84.81,75.5 87.44,75.5 SSW1.2
  Bottom 0.203: v23.82,91.25 23.69,91.25 23.69,92.62 IC7.21 | v77.81,79.88 78.44,79.25 v79.19,79.25
GPA1  (via drill 0.41)
  Top 0.203: v113.56,35.75 118.56,30.75 118.56,18.88 120.06,17.38 B7.P$5
  Bottom 0.203: v113.56,35.75 112.69,36.62 110.69,36.62 IC1.22 | B7ALT.P$5 127.69,17.25 120.19,17.25 B7.P$5
GPA1_2  (via drill 0.41)
  Top 0.203: v86.81,91.5 89.81,88.5 v97.94,88.5 | v108.56,81.62 108.56,77 107.06,75.5 SSW2.2
  Bottom 0.203: v86.81,91.5 24.44,91.5 24.44,92.62 IC7.22 | v97.94,88.5 104.81,81.62 v108.56,81.62
GPA2  (via drill 0.41)
  Top 0.203: v109.31,36.75 109.31,28.88 111.19,27 111.19,18.62 112.44,17.38 B6ALT.P$5
  Bottom 0.203: v109.31,36.75 109.81,37.25 110.56,37.25 IC1.23 | B6.P$5 104.94,17.25 112.44,17.25 B6ALT.P$5
GPA3  (via drill 0.41)
  Top 0.203: v107.69,35 100.19,27.5 100.19,25.25 97.31,22.38 97.31,17.38 B5ALT.P$5 97.19,17.25 89.69,17.25 B5.P$5
  Bottom 0.203: v107.69,35 107.69,36.12 109.44,37.88 110.56,37.88 IC1.24
GPA4  (via drill 0.41)
  Top 0.203: v115.31,49.62 v115.31,40.62 | v88.31,48.38 86.31,46.38 86.31,42.12 85.56,41.38 84.56,41.38 82.94,39.75 v82.94,38.62 | v19.57,25.5 v27.07,33
  Bottom 0.203: v115.31,40.62 113.69,40.62 111.81,38.75 110.81,38.75 110.69,38.62 IC1.25 | v115.31,49.62 114.06,50.88 91.06,50.88 88.56,48.38 v88.31,48.38 | v82.94,38.62 81.81,37.5 81.06,37.5 79.81,36.25 79.81,35.88 78.19,34.25 28.32,34.25 v27.07,33 | v19.57,25.5 21.69,23.38 22.57,23.38 23.57,22.38 24.57,22.38 28.57,18.38 28.57,17.38 B1.P$5 28.69,17.25 36.19,17.25 B1ALT.P$5
GPA5  (via drill 0.41)
  Top 0.203: v109.31,39.12 109.31,40.38 107.44,42.25 107.44,42.38 106.94,42.88 103.94,42.88 102.44,41.38 99.31,41.38 v95.81,44.88 | v95.31,43.38 95.31,35.5 88.56,28.75 v83.94,28.75 | v48.06,25.75 v51.56,29.25 | v46.69,25.12 43.94,22.38 43.94,17.38 B2.P$5
  Bottom 0.203: v109.31,39.12 110.44,39.12 110.56,39.25 IC1.26 | v95.81,44.88 95.81,43.38 v95.31,43.38 | v83.94,28.75 65.31,28.75 64.81,29.25 v51.56,29.25 | v48.06,25.75 47.44,25.12 v46.69,25.12 | B2ALT.P$5 51.44,17.25 43.94,17.25 B2.P$5
GPA6  (via drill 0.41)
  Top 0.203: v103.06,34.88 v106.81,38.62 | v86.44,32.25 78.69,24.5 v78.69,16.5
  Bottom 0.203: v106.81,38.62 108.06,39.88 110.56,39.88 IC1.27 | v103.06,34.88 102.94,34.75 88.94,34.75 v86.44,32.25 | v78.69,16.5 77.94,15.75 68.31,15.75 66.81,17.25 B3ALT.P$5 66.69,17.25 59.19,17.25 B3.P$5
GPA7  (via drill 0.41)
  Top 0.203: v98.06,37.62 85.31,24.88 84.56,24.88 82.06,22.38 82.06,17.38 B4ALT.P$5
  Bottom 0.203: v98.06,37.62 106.06,37.62 106.06,38.88 107.69,40.5 110.56,40.5 IC1.28 | B4.P$5 74.44,17.25 81.94,17.25 B4ALT.P$5
GPA8  (via drill 0.41)
  Top 0.203: v101.06,36.88 v105.56,41.38 | v78.06,38.88 v81.69,35.25
  Bottom 0.203: v105.56,41.38 117.06,41.38 117.81,40.62 IC1.1 | v101.06,36.88 99.44,35.25 v81.69,35.25 | v78.06,38.88 74.44,38.88 B16.P$5
GPA9  (via drill 0.41)
  Top 0.203: v108.06,46.5 v114.69,39.88 | v97.94,54.5 v104.44,48 | v78.94,54.5 75.31,50.88 67.94,50.88 62.19,45.12 62.19,40.88 60.19,38.88 59.19,38.88 B15.P$5
  Bottom 0.203: v114.69,39.88 117.81,39.88 IC1.2 | v108.06,46.5 106.56,48 v104.44,48 | v97.94,54.5 97.69,54.75 82.19,54.75 81.94,54.5 v78.94,54.5
GPA10  (via drill 0.41)
  Top 0.203: v93.81,53.5 v97.19,50.12 | v77.19,53.75 71.19,53.75 68.81,51.38 58.94,51.38 51.56,44 51.56,38.88 B14ALT.P$5
  Bottom 0.203: v97.19,50.12 107.06,50.12 108.94,48.25 119.06,48.25 119.06,39.62 118.81,39.38 117.94,39.38 IC1.3 | v93.81,53.5 93.06,54.25 82.31,54.25 81.81,53.75 v77.19,53.75 | B14.P$5 43.94,38.88 51.44,38.88 B14ALT.P$5
GPA11  (via drill 0.41)
  Top 0.203: v112.81,38.75 106.56,45 v106.56,45.12 | v87.94,39.38 v87.94,40.88 | v51.31,35.25 48.94,37.62 29.82,37.62 28.69,38.75 B13.P$5
  Bottom 0.203: v112.81,38.75 117.69,38.75 117.81,38.62 IC1.4 | v106.56,45.12 106.44,45.25 103.06,45.25 102.69,45.62 102.19,45.62 101.56,45 101.56,38.88 98.94,38.88 97.31,40.5 94.06,40.5 93.19,41.38 90.69,41.38 90.19,40.88 v87.94,40.88 | v87.94,39.38 87.44,38.88 83.69,38.88 83.19,39.38 80.31,39.38 77.31,36.38 77.31,34.75 51.81,34.75 v51.31,35.25
GPA12  (via drill 0.41)
  Top 0.203: v130.81,32.25 138.19,24.88 140.44,24.88 145.44,19.88 147.94,19.88 150.44,17.38 B9.P$5
  Bottom 0.203: v130.81,32.25 121.56,32.25 121.56,36 119.56,38 117.94,38 IC1.5 | B9ALT.P$5 158.06,17.25 150.56,17.25 B9.P$5
GPA13  (via drill 0.41)
  Top 0.203: v111.44,42.12 v116.19,37.38 | v106.69,42.12 106.69,40.38 110.44,36.62 v110.44,29.88 | v156.94,26.88 156.94,23.62 160.69,19.88 163.19,19.88 165.69,17.38 B10.P$5
  Bottom 0.203: v116.19,37.38 117.81,37.38 IC1.6 | v106.69,42.12 v111.44,42.12 | v110.44,29.88 153.94,29.88 v156.94,26.88 | B10ALT.P$5 173.31,17.25 165.81,17.25 B10.P$5
GPA14  (via drill 0.41)
  Top 0.203: v108.56,44 v114.56,38 | v103.19,44 97.69,44 96.06,45.62 v95.06,45.62 | v91.44,43.5 91.44,37.88 92.81,36.5 v92.81,34 | v163.19,30.38 168.69,24.88 170.94,24.88 175.94,19.88 178.44,19.88 180.94,17.38 B11.P$5 181.06,17.25 188.56,17.25 B11ALT.P$5
  Bottom 0.203: v114.56,38 115.94,36.62 117.81,36.62 IC1.7 | v103.19,44 v108.56,44 | v95.06,45.62 93.44,44 91.94,44 v91.44,43.5 | v92.81,34 94.81,32 109.31,32 110.94,30.38 v163.19,30.38
GPA15  (via drill 0.41)
  Top 0.203: v119.31,49 v119.31,37.25 | v87.06,53.5 87.06,51.88 82.19,47 82.19,38.38 v83.19,37.38 | v97.44,30.75 v97.44,36
  Bottom 0.203: v119.31,37.25 119.06,37.25 119.06,36.38 118.81,36.12 117.94,36.12 IC1.8 | v119.31,49 115.56,52.75 93.56,52.75 92.56,53.75 87.31,53.75 v87.06,53.5 | v83.19,37.38 96.06,37.38 v97.44,36 | v97.44,30.75 99.69,28.5 118.94,28.5 121.31,26.12 193.31,26.12 197.06,22.38 199.81,22.38 202.25,19.94 | 202.25,19.94 203.81,18.38 203.81,17.38 B12ALT.P$5 | B12.P$5 196.31,17.38 198.81,19.88 202.19,19.88 202.25,19.94
GPA16  (via drill 0.41)
  Top 0.203: v7.06,48.75 7.06,48.38 10.06,45.38 10.06,41.25 v21.57,29.75 | v78.06,33.5 v78.06,29.5 | v81.31,36.75 81.31,48.75 86.81,54.25 87.31,54.25 89.81,51.75 90.31,51.75 98.81,60.25 v98.81,62
  Bottom 0.203: v7.06,48.75 5.69,48.75 4.44,47.5 2.81,47.5 IC6.21 | v21.57,29.75 21.82,30 63.44,30 63.69,29.75 77.81,29.75 v78.06,29.5 | v81.31,36.75 v78.06,33.5 | v98.81,62 99.81,63 102.31,63 104.81,60.5 B24.P$5
GPA17  (via drill 0.41)
  Top 0.203: v1.31,47.5 1.31,45.88 2.44,44.75 v2.44,41.5 | v10.81,41.5 12.44,43.12 12.44,43.25 17.19,48 21.32,48 23.44,50.12 v34.56,50.12 | v68.94,52.5 69.31,52.5 76.44,59.62 v81.44,59.62
  Bottom 0.203: v1.31,47.5 1.81,48 2.69,48 IC6.22 | v2.44,41.5 2.69,41.75 10.56,41.75 v10.81,41.5 | v34.56,50.12 49.81,50.12 49.94,50 52.94,50 55.44,52.5 v68.94,52.5 | v81.44,59.62 82.19,60.38 89.56,60.38 B23.P$5
GPA18  (via drill 0.41)
  Top 0.203: v41.56,53.25 v37.69,49.38 | v67.19,53.25 74.31,60.38 B22.P$5
  Bottom 0.203: v37.69,49.38 34.31,49.38 32.94,50.75 21.32,50.75 21.32,46.25 18.32,43.25 17.19,43.25 16.19,42.25 0.56,42.25 0.56,47.75 1.44,48.62 2.69,48.62 IC6.23 | v67.19,53.25 v41.56,53.25
GPA19  (via drill 0.41)
  Top 0.203: v17.44,47.25 v13.19,43 | v50.19,50.75 59.06,59.62 59.06,60.38 B21.P$5
  Bottom 0.203: v13.19,43 8.06,43 4.94,46.12 4.69,46.12 4.69,47.12 5.81,48.25 6.56,48.25 6.81,48 7.81,48 7.81,49 7.31,49.5 2.81,49.5 IC6.24 | v17.44,47.25 20.82,50.62 20.82,51.25 33.19,51.25 33.44,51 49.94,51 v50.19,50.75 | B21ALT.P$5 66.69,60.5 59.19,60.5 B21.P$5
GPA20  (via drill 0.41)
  Top 0.203: v1.31,50 1.31,48.5 3.31,46.5 v3.31,41 | v81.31,32.75 87.19,38.62 89.44,38.62 89.56,38.75 B17.P$5
  Bottom 0.203: v1.31,50 2.69,50 IC6.25 | v3.31,41 12.06,32.25 47.94,32.25 48.94,33.25 65.06,33.25 65.56,32.75 v81.31,32.75 | B17ALT.P$5 97.19,38.88 89.69,38.88 B17.P$5
GPA21  (via drill 0.41)
  Top 0.203: v4.19,50.62 9.56,45.25 9.56,40.75 v20.07,30.25 | v78.94,30 78.94,31.5 86.31,38.88 86.31,41.5 88.31,43.5 v88.31,47.38 | v96.31,47.75 99.56,47.75 v102.44,44.88
  Bottom 0.203: v4.19,50.62 2.81,50.62 IC6.26 | v20.07,30.25 20.32,30.5 63.56,30.5 63.81,30.25 78.69,30.25 v78.94,30 | v88.31,47.38 88.69,47.75 v96.31,47.75 | v102.44,44.88 102.44,38.88 104.81,38.88 B18.P$5
GPA22  (via drill 0.41)
  Top 0.203: v4.94,52 4.94,52.5 10.44,58 v10.44,59
  Bottom 0.203: v4.94,52 4.31,51.38 2.81,51.38 IC6.27 | v10.44,59 11.69,60.25 28.44,60.25 28.57,60.38 B19.P$5
GPA23  (via drill 0.41)
  Top 0.203: v33.94,52.75 41.56,60.38 43.81,60.38 B20.P$5
  Bottom 0.203: v33.94,52.75 3.56,52.75 2.81,52 IC6.28 | B20ALT.P$5 51.44,60.5 43.94,60.5 B20.P$5
GPA26  (via drill 0.41)
  Top 0.203: v14.06,50.88 21.94,58.75 21.94,61.25 23.69,63 24.57,63 25.44,63.88 25.44,68.38 v24.19,69.62 | v39.56,71.75 42.81,71.75 46.81,75.75 47.56,75.75 49.31,77.5 49.31,80.75 52.31,83.75 52.31,86.62 54.56,88.88 56.69,88.88 v57.06,88.5 | v97.31,78 v97.31,79.5
  Bottom 0.203: v14.06,50.88 13.94,50.75 10.06,50.75 IC6.3 | v24.19,69.62 25.69,71.12 29.44,71.12 30.07,71.75 v39.56,71.75 | v57.06,88.5 57.19,88.38 89.06,88.38 90.31,87.12 90.31,84.75 92.06,84.75 v97.31,79.5 | v97.31,78 99.56,75.75 104.81,75.75 B30.P$5
GPA27  (via drill 0.41)
  Top 0.203: v24.82,58.5 v16.44,50.12 | v56.31,59.12 56.31,59.38 59.94,63 62.69,63 64.56,64.88 64.56,65.25 66.19,66.88 67.31,66.88 70.94,70.5 70.94,74.12 68.56,76.5 68.56,80 69.31,80.75 v71.31,80.75
  Bottom 0.203: v16.44,50.12 10.06,50.12 IC6.4 | v24.82,58.5 25.07,58.75 29.82,58.75 30.19,59.12 v56.31,59.12 | v71.31,80.75 73.81,83.25 80.56,83.25 B29.P$5
GPA28  (via drill 0.41)
  Top 0.203: v11.94,49.38 11.94,54.62 11.81,54.75 11.81,70.62 16.44,75.25 28.19,75.25 28.57,75.62 B25.P$5
  Bottom 0.203: v11.94,49.38 10.06,49.38 IC6.5
GPA29  (via drill 0.41)
  Top 0.203: v15.94,48.62 26.57,59.25 32.19,59.25 36.19,63.25 36.19,82 B26.P$5 34.94,83.38 42.44,83.38 B26ALT.P$5
  Bottom 0.203: v15.94,48.62 10.06,48.62 IC6.6
GPA30  (via drill 0.41)
  Top 0.203: v8.56,48.75 8.56,55 v10.44,56.88 | v34.19,60.25 34.19,60.62 36.94,63.38 36.94,72.88 39.81,75.75 40.19,75.75 45.19,80.75 47.56,80.75 50.06,83.25 B27.P$5
  Bottom 0.203: v8.56,48.75 9.19,48.12 9.94,48.12 IC6.7 | v10.44,56.88 15.19,56.88 17.57,59.25 29.69,59.25 30.69,60.25 v34.19,60.25 | B27ALT.P$5 57.69,83.38 50.19,83.38 B27.P$5
GPA31  (via drill 0.41)
  Top 0.203: v6.31,47.5 3.44,50.38 3.44,53.12 v5.06,54.75 | v54.56,58.38 61.69,65.5 62.69,65.5 65.44,68.25 65.44,74 66.56,75.12 66.56,82.12 65.44,83.25 B28.P$5
  Bottom 0.203: v6.31,47.5 9.94,47.5 IC6.8 | v5.06,54.75 6.44,56.12 12.06,56.12 12.19,56.25 19.69,56.25 20.19,55.75 32.06,55.75 32.56,56.25 53.19,56.25 54.56,57.62 v54.56,58.38
GPB0  (via drill 0.41)
  Top 0.203: v72.31,83.38 74.94,80.75 SSW1.8
  Bottom 0.203: v72.31,83.38 69.56,83.38 66.06,86.88 29.69,86.88 28.32,85.5 IC7.1
GPB1
  Bottom 0.203: IC7.2 27.69,85.5 27.69,87.38 72.31,87.38 72.81,87.88 86.56,87.88 93.69,80.75 94.44,80.75 SSW2.8
I2C_SCL  (via drill 0.41)
  Top 0.203: v1.69,26.75 3.56,28.62 3.56,29.5 v3.44,29.62 | v8.31,44.75 7.56,44 v7.56,32 7.56,27.5 23.44,11.62 43.56,11.62 44.06,12.12 46.69,12.12 48.06,10.75 63.81,10.75 | 63.81,10.75 v65.19,10.75 | v77.56,52.12 77.19,52.12 75.44,50.38 68.06,50.38 64.56,46.88 64.56,32 | 64.56,32 64.56,15.88 67.06,13.38 67.06,9 66.56,8.5 66.06,8.5 63.81,10.75 | v1.56,70.38 1.56,75.38 3.56,77.38 v3.56,80.62 3.56,83.62 6.06,86.12 v8.06,86.12 | SERIAL2.4 116.19,73.62 117.44,74.88 119.19,74.88 120.56,73.5 120.56,37.5 119.31,36.25 v119.31,32.88 119.81,32.38 119.81,31.25 119.31,30.75 v119.31,29.12 | v108.56,90.62 v92.56,90.62 | v64.31,32 64.56,32
  Bottom 0.203: v1.69,26.75 1.69,25.25 2.81,24.12 3.31,24.12 IC2.26 | v3.44,29.62 3.56,29.75 5.31,29.75 v7.56,32 | v8.31,44.75 9.94,44.75 IC6.12 | v65.19,10.75 69.19,10.75 IC3.26 | v77.56,52.12 81.94,52.12 81.94,51 IC8.12 | v1.56,70.38 1.56,67.75 2.06,67.25 3.31,67.25 IC4.26 | v3.56,80.62 4.94,82 5.44,82 IC5.26 | 21.07,86.88 21.07,85.5 IC7.12 | 21.07,86.88 12.19,86.88 11.44,86.12 v8.06,86.12 | v119.31,32.88 118.81,33.38 117.94,33.38 IC1.12 | 21.07,86.88 24.82,90.62 v92.56,90.62 | v108.56,90.62 120.06,79.12 120.06,74.88 117.44,74.88 116.19,73.62 SERIAL2.4 | v64.31,32 64.56,31.75 80.69,31.75 80.94,31.5 107.81,31.5 110.19,29.12 v119.31,29.12
I2C_SDA  (via drill 0.41)
  Top 0.203: v3.94,30.5 4.19,30.25 4.19,28.62 2.44,26.88 v2.44,25.88 2.44,24.75 4.81,22.38 4.81,12 10.19,6.62 65.31,6.62 67.81,9.12 v67.81,12.25 67.81,13.88 65.06,16.62 65.06,46.75 68.19,49.88 75.56,49.88 75.81,50.12 v79.94,50.12 81.69,51.88 v81.69,55.25 | v8.56,43.75 v8.56,34 | v2.31,68 2.31,75.5 4.31,77.5 v4.31,82.38 | v7.31,82.62 v8.94,84.25 | v11.31,44.62 11.31,49 11.19,49.12 11.19,66.38 11.31,66.5 11.31,84 v11.56,84.25 | v119.06,31.5 119.06,32.12 118.56,32.62 118.56,52 | 118.56,52 118.56,63.25 120.06,64.75 120.06,72.25 118.81,73.5 SERIAL2.3 | v114.69,52 118.56,52 | v98.94,54.5 v101.44,52
  Bottom 0.203: v2.44,25.88 2.44,25.12 2.81,24.75 3.31,24.75 IC2.27 | v3.94,30.5 4.31,30.88 5.44,30.88 v8.56,34 | v8.56,43.75 8.94,44.12 9.94,44.12 IC6.13 10.06,44.25 10.94,44.25 v11.31,44.62 | v2.31,68 3.19,68 3.31,67.88 IC4.27 | v4.31,82.38 4.56,82.62 5.44,82.62 IC5.27 5.56,82.62 v7.31,82.62 | v8.94,84.25 v11.56,84.25 20.32,84.25 20.32,85.38 IC7.13 | v119.06,31.5 116.81,31.5 116.81,32.5 116.94,32.62 117.69,32.62 117.81,32.75 IC1.13 | v67.81,12.25 68.56,11.5 69.06,11.5 69.19,11.38 IC3.27 | v79.94,50.12 80.19,49.88 81.06,49.88 81.31,50.12 81.31,50.88 IC8.13 | v101.44,52 v114.69,52 | v98.94,54.5 98.19,55.25 v81.69,55.25
L0
  Top 0.203: B1.P$2 24.19,23.62 31.69,23.62 B1ALT.P$2
  Bottom 0.203: R23.1 33.44,22.38 32.19,23.62 31.82,23.62 B1ALT.P$2
L1
  Top 0.203: B1.P$3 24.19,18.62 31.69,18.62 B1ALT.P$3
  Bottom 0.203: R22.1 33.44,19.75 32.31,18.62 31.82,18.62 B1ALT.P$3
L2
  Bottom 0.203: R21.1 48.56,22.38 47.31,23.62 47.06,23.62 B2ALT.P$2 46.94,23.62 39.44,23.62 B2.P$2
L3
  Bottom 0.203: R20.1 48.56,19.75 47.44,18.62 47.06,18.62 B2ALT.P$3 46.94,18.62 39.44,18.62 B2.P$3
L4
  Bottom 0.203: B3.P$2 54.69,23.62 54.94,23.62 56.19,22.38 R19.1 57.56,23.62 62.19,23.62 B3ALT.P$2
L5
  Bottom 0.203: B3.P$3 54.69,18.62 55.06,18.62 56.19,19.75 R18.1 56.31,19.75 57.44,18.62 62.19,18.62 B3ALT.P$3
L6
  Bottom 0.203: R17.1 68.19,22.38 69.44,23.62 69.81,23.62 B4.P$2 69.94,23.62 77.44,23.62 B4ALT.P$2
L7
  Bottom 0.203: R16.1 68.19,19.75 69.31,18.62 69.81,18.62 B4.P$3 69.94,18.62 77.44,18.62 B4ALT.P$3
L8
  Bottom 0.203: R15.1 83.44,22.38 84.69,23.62 85.06,23.62 B5.P$2 85.19,23.62 92.69,23.62 B5ALT.P$2
L9
  Bottom 0.203: R14.1 83.44,19.75 84.56,18.62 85.06,18.62 B5.P$3 85.19,18.62 92.69,18.62 B5ALT.P$3
L10
  Top 0.203: B6.P$2 100.44,23.62 B6ALT.P$2
  Bottom 0.203: R13.1 98.69,22.38 99.94,23.62 100.31,23.62 B6.P$2
L11
  Bottom 0.203: R12.1 98.69,19.75 99.81,18.62 100.31,18.62 B6.P$3 100.44,18.62 107.94,18.62 B6ALT.P$3
L12
  Bottom 0.203: R11.1 113.94,22.38 115.19,23.62 B7.P$2 115.69,23.62 B7ALT.P$2
L13
  Bottom 0.203: R10.1 113.94,19.75 115.06,18.62 115.56,18.62 B7.P$3 115.69,18.62 123.19,18.62 B7ALT.P$3
L14
  Top 0.203: B8.P$2 138.31,23.62 B8ALT.P$2
  Bottom 0.203: R4.1 129.19,22.38 130.44,23.62 130.69,23.62 B8.P$2
L15
  Top 0.203: B8.P$3 130.81,18.62 138.31,18.62 B8ALT.P$3
  Bottom 0.203: R3.1 130.31,18.62 130.69,18.62 B8.P$3
L16
  Bottom 0.203: R39.1 144.44,22.38 145.69,23.62 145.94,23.62 B9.P$2 146.06,23.62 153.56,23.62 B9ALT.P$2
L17
  Bottom 0.203: R38.1 144.44,19.75 145.56,18.62 145.94,18.62 B9.P$3 146.06,18.62 153.56,18.62 B9ALT.P$3
L18
  Top 0.203: B10.P$2 161.31,23.62 168.81,23.62 B10ALT.P$2
  Bottom 0.203: R37.1 159.69,22.38 160.94,23.62 161.19,23.62 B10.P$2
L19
  Bottom 0.203: R36.1 159.69,19.75 160.81,18.62 161.19,18.62 B10.P$3 161.31,18.62 168.81,18.62 B10ALT.P$3
L20
  Top 0.203: B11.P$2 176.56,23.62 184.06,23.62 B11ALT.P$2
  Bottom 0.203: R35.1 174.94,22.38 176.19,23.62 176.44,23.62 B11.P$2
L21
  Bottom 0.203: R34.1 174.94,19.75 176.06,18.62 176.44,18.62 B11.P$3 176.56,18.62 184.06,18.62 B11ALT.P$3
L22
  Top 0.203: B12.P$2 191.81,23.62 199.31,23.62 B12ALT.P$2
  Bottom 0.203: R33.1 190.19,22.38 191.44,23.62 191.69,23.62 B12.P$2
L23
  Top 0.203: B12.P$3 191.81,18.62 199.31,18.62 B12ALT.P$3
  Bottom 0.203: R32.1 190.19,19.75 191.31,18.62 191.69,18.62 B12.P$3
L24
  Bottom 0.203: R31.1 21.69,44.88 21.94,45.12 24.07,45.12 B13.P$2
L25
  Bottom 0.203: R30.1 23.32,36.38 23.32,38.25 24.07,39 24.07,40.12 B13.P$3
L26
  Top 0.203: B14.P$2 39.44,45.25 46.94,45.25 B14ALT.P$2
  Bottom 0.203: R29.1 48.56,44 47.44,45.12 47.06,45.12 B14ALT.P$2
L27
  Top 0.203: B14.P$3 39.44,40.12 46.94,40.12 B14ALT.P$3
  Bottom 0.203: R28.1 48.56,41.38 47.44,40.25 47.06,40.25 B14ALT.P$3
L28
  Bottom 0.203: R27.1 56.19,44 55.06,45.12 54.69,45.12 B15.P$2
L29
  Bottom 0.203: R26.1 56.19,41.38 55.06,40.25 54.69,40.25 B15.P$3
L30
  Bottom 0.203: R25.1 71.44,44 70.31,45.12 69.94,45.12 B16.P$2
L31
  Bottom 0.203: R24.1 71.44,41.38 70.31,40.25 69.94,40.25 B16.P$3
L32
  Bottom 0.203: R55.1 83.44,44 84.56,45.12 85.06,45.12 B17.P$2 85.19,45.25 92.69,45.25 B17ALT.P$2
L33
  Bottom 0.203: R54.1 83.44,41.38 84.56,40.25 85.06,40.25 B17.P$3 85.19,40.12 92.69,40.12 B17ALT.P$3
L34
  Bottom 0.203: R53.1 99.81,45.12 100.31,45.12 B18.P$2
L35
  Bottom 0.203: R52.1 98.69,41.38 99.81,40.25 100.31,40.25 B18.P$3
L36
  Bottom 0.203: R51.1 22.44,65.62 23.57,66.75 24.07,66.75 B19.P$2
L37
  Bottom 0.203: R50.1 23.69,61.75 24.07,61.75 B19.P$3
L38
  Top 0.203: B20.P$2 39.44,66.88 46.94,66.88 B20ALT.P$2
  Bottom 0.203: R49.1 37.69,65.62 38.81,66.75 39.31,66.75 B20.P$2
L39
  Bottom 0.203: R48.1 38.94,61.75 39.31,61.75 B20.P$3 39.44,61.75 46.94,61.75 B20ALT.P$3
L40
  Top 0.203: B21.P$2 54.69,66.88 62.19,66.88 B21ALT.P$2
  Bottom 0.203: R47.1 52.94,65.62 54.06,66.75 54.56,66.75 B21.P$2
L41
  Bottom 0.203: R46.1 52.94,63 54.19,61.75 54.56,61.75 B21.P$3 54.69,61.75 62.19,61.75 B21ALT.P$3
L42
  Bottom 0.203: R45.1 68.19,65.62 69.31,66.75 69.81,66.75 B22.P$2
L43
  Bottom 0.203: R44.1 68.19,63 69.44,61.75 69.81,61.75 B22.P$3
L44
  Bottom 0.203: R43.1 83.44,65.62 84.56,66.75 85.06,66.75 B23.P$2
L45
  Bottom 0.203: R42.1 83.44,63 84.69,61.75 85.06,61.75 B23.P$3
L46
  Bottom 0.203: R41.1 96.19,61.38 96.19,66 99.56,66 100.31,66.75 B24.P$2
L47
  Bottom 0.203: R40.1 96.19,59.62 97.81,61.25 99.94,61.25 100.31,61.62 B24.P$3
L48
  Bottom 0.203: R71.1 22.44,80.88 23.57,82 24.07,82 B25.P$2
L49
  Bottom 0.203: R70.1 22.44,78.12 23.57,77 24.07,77 B25.P$3
L50
  Bottom 0.203: R69.1 37.69,78.12 38.81,77 39.31,77 B26.P$2 39.44,77 46.94,77 B26ALT.P$2
L51
  Top 0.203: B26.P$3 39.44,82 46.94,82 B26ALT.P$3
  Bottom 0.203: R68.1 37.69,80.88 38.81,82 39.31,82 B26.P$3
L52
  Bottom 0.203: R67.1 52.94,78.12 54.06,77 54.56,77 B27.P$2 54.69,77 62.19,77 B27ALT.P$2
L53
  Bottom 0.203: R66.1 52.94,80.88 54.06,82 54.56,82 B27.P$3 54.69,82 62.19,82 B27ALT.P$3
L54
  Bottom 0.203: R65.1 68.19,78.12 69.31,77 69.81,77 B28.P$2
L55
  Bottom 0.203: R64.1 68.19,80.88 69.31,82 69.81,82 B28.P$3
L56
  Bottom 0.203: R63.1 84.69,74.5 84.69,76.88 85.06,76.88 B29.P$2
L57
  Bottom 0.203: R62.1 84.69,84.5 84.69,82.12 85.06,82.12 B29.P$3
L58
  Bottom 0.203: R61.1 98.69,83.25 99.81,82.12 100.31,82.12 B30.P$2
L59
  Bottom 0.203: R60.1 102.81,78.62 101.19,77 100.44,77 B30.P$3
MOSI  (via drill 0.41)
  Top 0.203: SSW1.6 75.06,78.88 77.81,78.88 80.94,82 83.31,82 85.69,84.38 92.44,84.38 95.69,81.12 95.69,80 94.56,78.88 SSW2.6 | v101.56,78.62 v103.94,78.62
  Bottom 0.203: v103.94,78.62 116.06,78.62 SERIAL2.8 | v101.56,78.62 101.19,78.25 98.06,78.25 97.56,78.75 94.56,78.75 SSW2.6
N$1
  Bottom 0.356: L2.1 116.31,69 116.31,71 116.19,71 SERIAL2.2
N$2
  Top 0.203: U$66.2 109.94,54.12 108.56,54.12 101.56,61.12 101.56,68 97.81,71.75 SW1.B
  Bottom 0.203: R58.1 R56.2 96.94,71.75 97.69,71.75 SW1.B
N$4  (via drill 0.41)
  Top 0.203: v16.94,13.12 v12.44,17.62 | v68.19,17 v66.94,15.75
  Bottom 0.203: v12.44,17.62 9.31,17.62 IC2.13 | v16.94,13.12 40.56,13.12 41.69,14.25 41.69,15.12 43.81,15.12 45.31,13.62 64.81,13.62 v66.94,15.75 | v68.19,17 68.19,19 67.31,19 66.56,19.75 R16.2
N$5  (via drill 0.41)
  Top 0.203: v22.07,21.38 22.07,23.38 24.32,25.62 v27.19,25.62 | v67.06,26.38 67.94,25.5 v67.94,23.75
  Bottom 0.203: v22.07,21.38 18.82,18.12 18.32,18.12 18.07,18.38 12.19,18.38 12.06,18.25 9.31,18.25 IC2.12 | v27.19,25.62 27.94,26.38 43.19,26.38 45.31,28.5 64.94,28.5 v67.06,26.38 | v67.94,23.75 66.56,22.38 R17.2
N$6  (via drill 0.41)
  Top 0.203: v18.57,18.88 24.82,12.62 43.31,12.62 43.81,13.12 50.19,13.12 v52.06,15 | v62.06,16.5 62.06,17 60.94,18.12 60.94,19.38 v61.06,19.5
  Bottom 0.203: v18.57,18.88 9.31,18.88 IC2.11 | v52.06,15 52.81,15.75 61.31,15.75 v62.06,16.5 | v61.06,19.5 60.81,19.75 58.06,19.75 R18.2
N$8  (via drill 0.41)
  Top 0.203: v16.82,19.62 24.32,12.12 43.44,12.12 43.94,12.62 52.69,12.62 54.81,14.75 54.81,17 56.81,19 v56.81,25.62 | v61.06,26.12 61.06,24.25 60.94,24.12 60.94,22.75 v61.06,22.62
  Bottom 0.203: v16.82,19.62 16.57,19.38 9.31,19.38 IC2.10 | v56.81,25.62 57.31,26.12 v61.06,26.12 | v61.06,22.62 60.81,22.38 58.06,22.38 R19.2
N$12  (via drill 0.41)
  Top 0.203: v15.94,20.12 16.32,20.12 16.82,20.62 18.44,20.62 24.32,14.75 24.32,14.38 25.07,13.62 43.06,13.62 46.69,17.25 47.81,17.25 v49.31,18.75
  Bottom 0.203: v15.94,20.12 9.31,20.12 IC2.9 | v49.31,18.75 50.31,19.75 R20.2
N$13  (via drill 0.41)
  Top 0.203: v18.19,19.88 18.57,19.88 23.82,14.62 23.82,14.25 24.94,13.12 43.19,13.12 43.69,13.62 46.06,13.62 47.19,14.75 47.19,15.12 51.19,19.12 51.81,19.12 52.31,19.62 v52.31,21.88
  Bottom 0.203: v18.19,19.88 17.19,20.88 9.31,20.88 IC2.8 | v52.31,21.88 51.94,22.25 50.44,22.25 R21.2
N$16  (via drill 0.41)
  Top 0.203: v20.19,20.62 24.82,16 31.32,16 v34.06,18.75
  Bottom 0.203: v20.19,20.62 19.44,21.38 9.31,21.38 IC2.7 | v34.06,18.75 35.06,19.75 R22.2
N$22  (via drill 0.41)
  Top 0.203: v20.19,22.12 24.44,26.38 31.07,26.38 v33.94,23.5
  Bottom 0.203: v20.19,22.12 9.31,22.12 IC2.6 | v33.94,23.5 35.06,22.38 R23.2
N$23  (via drill 0.41)
  Top 0.203: v21.82,20 20.44,21.38 19.57,21.38 19.07,21.88 19.07,23.62 v28.44,33 | v65.81,33.5 65.81,31.75 70.06,27.5 70.06,25.12 71.81,23.38 v71.81,22.88
  Bottom 0.203: v21.82,20 17.94,16.12 4.06,16.12 3.44,16.75 IC2.15 | v28.44,33 29.19,33.75 65.56,33.75 v65.81,33.5 | v71.81,22.88 76.44,22.88 76.94,22.38 81.69,22.38 R15.2
N$30  (via drill 0.41)
  Top 0.203: v53.19,17.25 53.19,25.75 54.44,27 54.44,31.12 v50.31,35.25 | v65.81,36 65.81,34.5 72.56,27.75 v72.56,20
  Bottom 0.203: v53.19,17.25 51.94,16 37.81,16 35.44,13.62 17.44,13.62 16.44,14.62 2.56,14.62 2.56,17.12 2.81,17.38 3.19,17.38 3.31,17.5 IC2.16 | v50.31,35.25 50.31,37.38 64.44,37.38 v65.81,36 | v72.56,20 72.56,19.38 76.56,19.38 77.06,19.88 81.69,19.88 R14.2
N$31  (via drill 0.41)
  Top 0.203: v1.69,18.12 1.69,18.5 v0.69,19.5 | v87.44,22.88 v87.44,25.62
  Bottom 0.203: v1.69,18.12 3.31,18.12 IC2.17 | v0.69,19.5 0.69,28.12 16.94,28.12 19.82,31 63.69,31 63.94,30.75 80.44,30.75 81.69,29.5 85.81,29.5 87.44,27.88 v87.44,25.62 | v87.44,22.88 87.94,22.38 96.94,22.38 R13.2
N$32  (via drill 0.41)
  Top 0.203: v2.31,18.88 2.31,24.25 0.94,25.62 0.94,27 v2.81,28.88 | v97.56,26.38 98.44,25.5 98.44,24.12 95.81,21.5 v95.81,20.38
  Bottom 0.203: v2.31,18.88 3.31,18.88 IC2.18 | v2.81,28.88 17.07,28.88 19.69,31.5 63.81,31.5 64.06,31.25 80.56,31.25 81.81,30 87.44,30 91.06,26.38 v97.56,26.38 | v95.81,20.38 96.31,19.88 96.94,19.88 R12.2
N$33  (via drill 0.41)